# EAGLE schematic myRolloCtl (EAGLE 7.6.0)
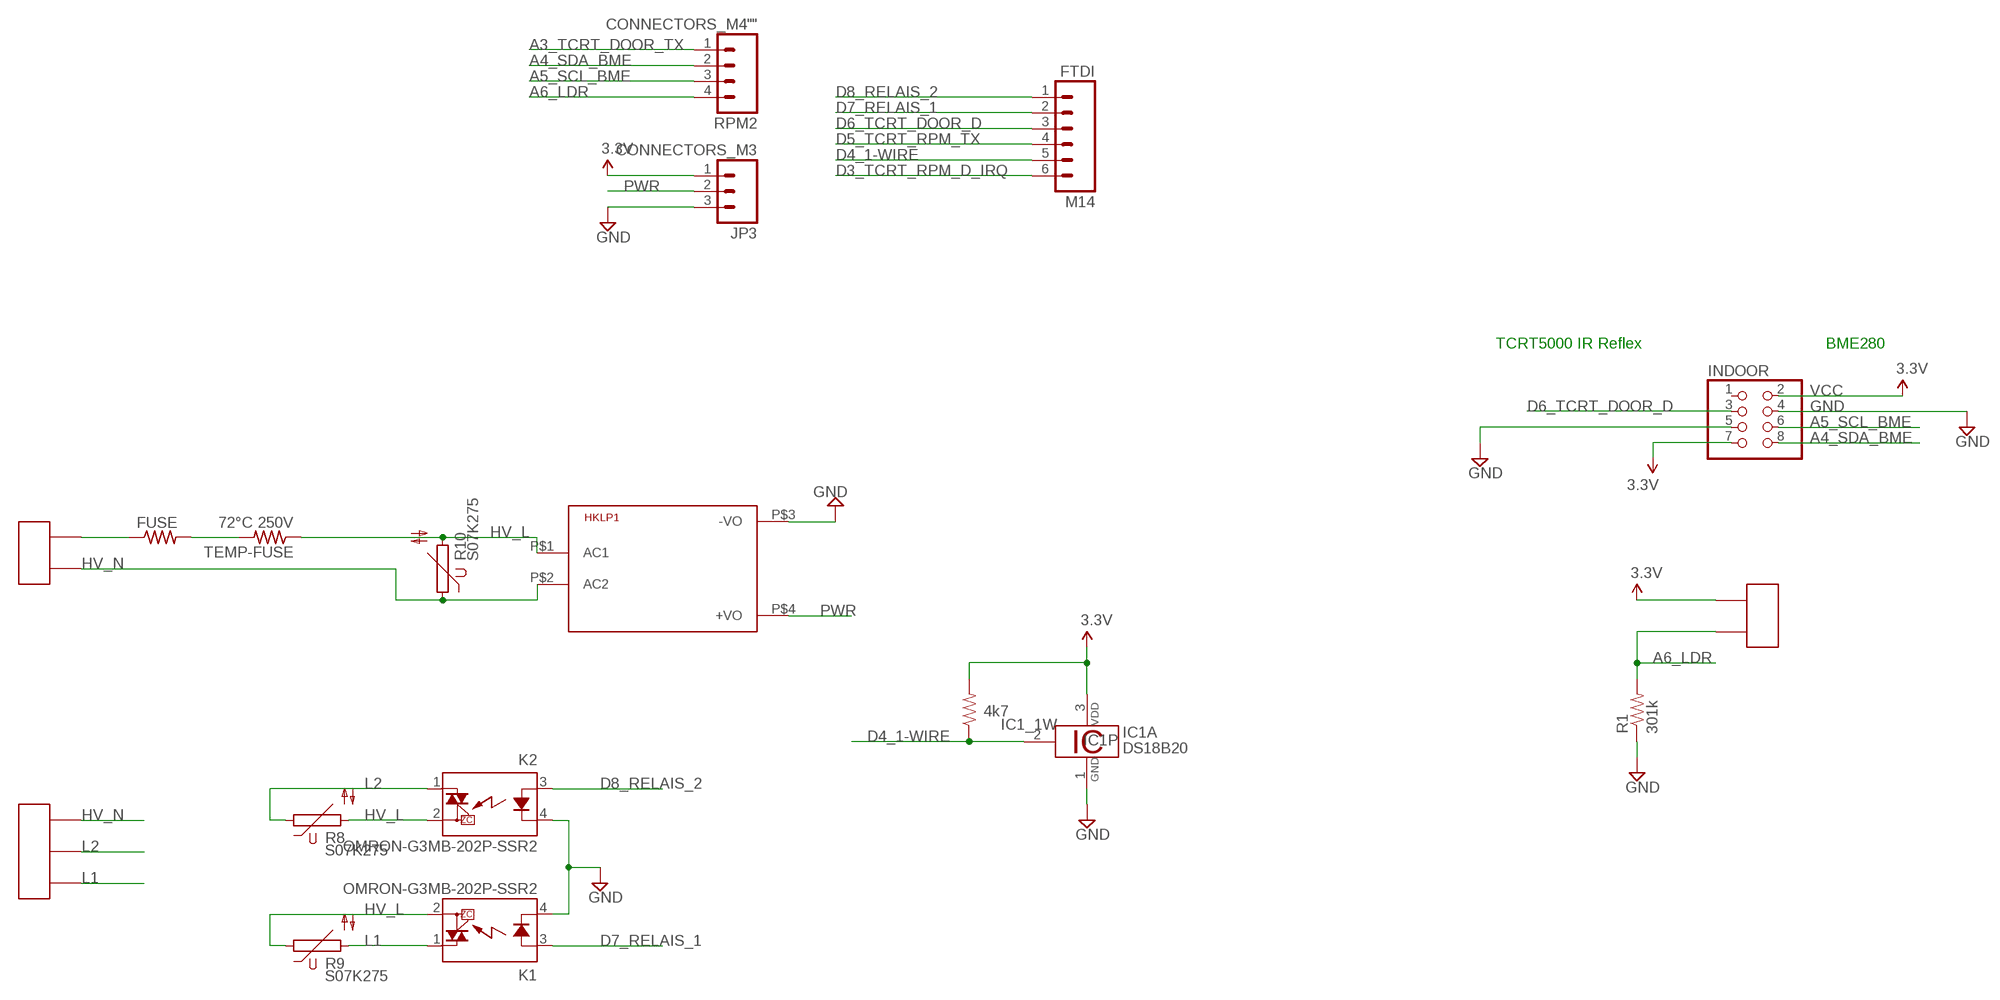
[diagram p0: schematic, sheet 1]

## Parts
FUSE  R-US_0613/5V  [P0613V]
HKLP1  HKLPM01  [HKLPM01]
IC1  DS18B20  [TO92-]
INDOOR  PINHD-2X4  [2X04]
JP3  CONNECTORS_M3  [CONNECTORS_1X3]
K1  OMRON-G3MB-202P-SSR2  [OMRON-G3MB-202P-SSR]
K2  OMRON-G3MB-202P-SSR2  [OMRON-G3MB-202P-SSR]
M14  FTDI  M06SIP  [1X06]
R1  301k  RESISTOR0603-RES  [0603-RES]
R4  4k7  RESISTOR0603-RES  [0603-RES]
R8  S07K275  [S07K275]
R9  S07K275  [S07K275]
R10  S07K275  [S07K275]
RPM2  CONNECTORS_M4""  [CONNECTORS_1X4]
TEMP-FUSE  72°C 250V  R-US_0207/2V  [0207/2V]
U$2  HDR_2PIN  [1X02_NS]
U$3  HDR_3PIN  [1X03_LUMBERG-KRMC_3,5MM]
U$6  HDR_2PIN1X02_3.5MM  [1X02_LUMBERG-KRMC_3,5MM]

## Nets
A3_TCRT_DOOR_TX: RPM2.1
A4_SDA_BME: INDOOR.8 RPM2.2
A5_SCL_BME: INDOOR.6 RPM2.3
A6_LDR: R1.2 RPM2.4 U$2.2
D3_TCRT_RPM_D_IRQ: M14.6
D4_1-WIRE: IC1.2 M14.5 R4.1
D5_TCRT_RPM_TX: M14.4
D6_TCRT_DOOR_D: INDOOR.3 M14.3
D7_RELAIS_1: K1.3(A) M14.2
D8_RELAIS_2: K2.3(A) M14.1
GND: HKLP1.P$3(-VO) IC1.1 INDOOR.4 INDOOR.5 JP3.3 K1.4(K) K2.4(K) R1.1
HV_L [HV]: HKLP1.P$1(AC1) K1.2(DS2) K2.2(DS2) R8.2 R9.1 R10.2 TEMP-FUSE.1
HV_N [HV]: HKLP1.P$2(AC2) R10.1 U$3.3 U$6.1
L1 [HV]: K1.1(DS1) R9.2 U$3.1
L2 [HV]: K2.1(DS1) R8.1 U$3.2
N$5 [HV]: FUSE.2 TEMP-FUSE.2
N$7 [HV]: FUSE.1 U$6.2
PWR [power]: HKLP1.P$4(+VO) JP3.2
VCC [power]: IC1.3 INDOOR.2 INDOOR.7 JP3.1 R4.2 U$2.1 ; supply symbol labelled 3.3V
Unconnected: INDOOR.1

## Notes on the sheet
- TCRT5000 IR Reflex | BME280

## Library data of the parts
FUSE = resistor:R-US_: RESISTOR, American symbol
HKLP1 = myLib:HKLPM01
IC1 = myLib:DS18B20: Programmable Resolution Digital Thermometer This chip provides a onewire thermosensor with approx. 0.5°C accuracy. A programmable over/undertemperure alarm is available. The precision can be set from 9..12 bits. Notes: Vdd must be applied for accurate measurements at low temperatures, as the parasite power circuit otherwise heats the sensor. If parasite power is used, Vdd has to be connected to GND. The DS1822 is a low-cost thermometer chip, the DS18S20 is similar to the DS18B20, but with 9 Bit precision only. Author: Jan Kandziora <jjj@gmx.de>
INDOOR = pinhead:PINHD-2X4: PIN HEADER
JP3 = myLib:CONNECTORS_M3: 13-pin single row .1" header
K1 K2 = Omron G3MB 202p SSR:OMRON-G3MB-202P-SSR: IT(rms) 8A, Zero Cross type SIP 4pin Triac output SSR Source: http://sharp-world.com/products/device/lineup/data/pdf/datasheet/s102s02_e.pdf; MPN: S202S02F; OC_FARNELL: 1618475; OC_NEWARK: 14N9588
M14 = SparkFun-Connectors:M06: Header 6 Standard 6-pin 0.1" header. Use with straight break away headers (SKU : PRT-00116), right angle break away headers (PRT-00553), swiss pins (PRT-00743), machine pins (PRT-00117), and female headers (PRT-00115). Molex polarized connector foot print use with SKU : PRT-08094 with associated crimp pins and housings. NOTES ON THE VARIANTS LOCK and LOCK_LONGPADS... This footprint was designed to help hold the alignment of a through-hole component (i.e. 6-pin header) while soldering it into place. You may notice that each hole has been shifted either up or down by 0.005 of an inch from it's more standard position (which is a perfectly straight line). This slight alteration caused the pins (the squares in the middle) to touch the edges of the holes. Because they are alternating, it causes a "brace" to hold the component in place. 0.005 has proven to be the perfect amount of "off-center" position when using our standard breakaway headers. Although looks a little odd when you look at the bare footprint, once you have a header in there, the alteration is very hard to notice. Also, if you push a header all the way into place, it is covered up entirely on the bottom side. This idea of altering the position of holes to aid alignment will be further integrated into the Sparkfun Library for other footprints. It can help hold any component with 3 or more connection pins.; BUERKLIN: 59 F 2134
R1 = LowPowerLab:RESISTOR: Resistor Basic schematic elements and footprints for 0603, 1206, and PTH resistors.; BUERKLIN: 26 E 7197
R4 = LowPowerLab:RESISTOR: Resistor Basic schematic elements and footprints for 0603, 1206, and PTH resistors.; BUERKLIN: 26 E 808
R8-R10 = varistor:S07K275: VARISTOR; BUERKLIN: 82 E 2252
RPM2 = myLib:CONNECTORS_M4: 13-pin single row .1" header
TEMP-FUSE = resistor:R-US_: RESISTOR, American symbol; BUERKLIN: 30G4800
U$2 = myLib:HDR_2PIN
U$3 = myLib:HDR_3PIN; BUERKLIN: 08 H 602
U$6 = myLib:HDR_2PIN; BUERKLIN: 08 H 600

## Net classes
0 default: width 0.305 mm, clearance 0.254 mm
1 power: width 0.381 mm, clearance 0.254 mm
2 HV: width 0.762 mm, clearance 1.651 mm